# Altium schematic sheet Control and Gauge.SchDoc
size 431 x 279 mm; Date: Not shown in title block; ApprovedBy: Not shown in title block; CheckedBy: Not shown in title block; Author: Not shown in title block; CompanyName: Not shown in title block; Engineer: Not shown in title block; Organization: Not shown in title block; Address1: Not shown in title block; Address2: Not shown in title block; Address3: Not shown in title block; Address4: Not shown in title block; DocumentNumber: 1; Revision: Use project parameter SCH_Rev; SheetNumber: 2; SheetTotal: 3; PageSetup: Record=PageOptions|CenterHorizontal=True|CenterVertical=True|PrintScale=1.00|XCorrection=1.00|YCorrection=1.00|PrintKind=0|BorderSize=5000000|LeftOffset=0|BottomOffset=0|Orientation=2|PaperLength=1000|PaperWidth=1000|Scale=100|PaperSource=15|PrintQuality=600|MediaType=1|DitherType=10|PaperKind=Letter|PrintScaleMode=1; CurrentTime: Not shown in title block; CurrentDate: Not shown in title block; Time: Not shown in title block; DocumentFullPathAndName: Not shown in title block; DocumentName: Not shown in title block; ModifiedDate: Not shown in title block; ImagePath: Not shown in title block
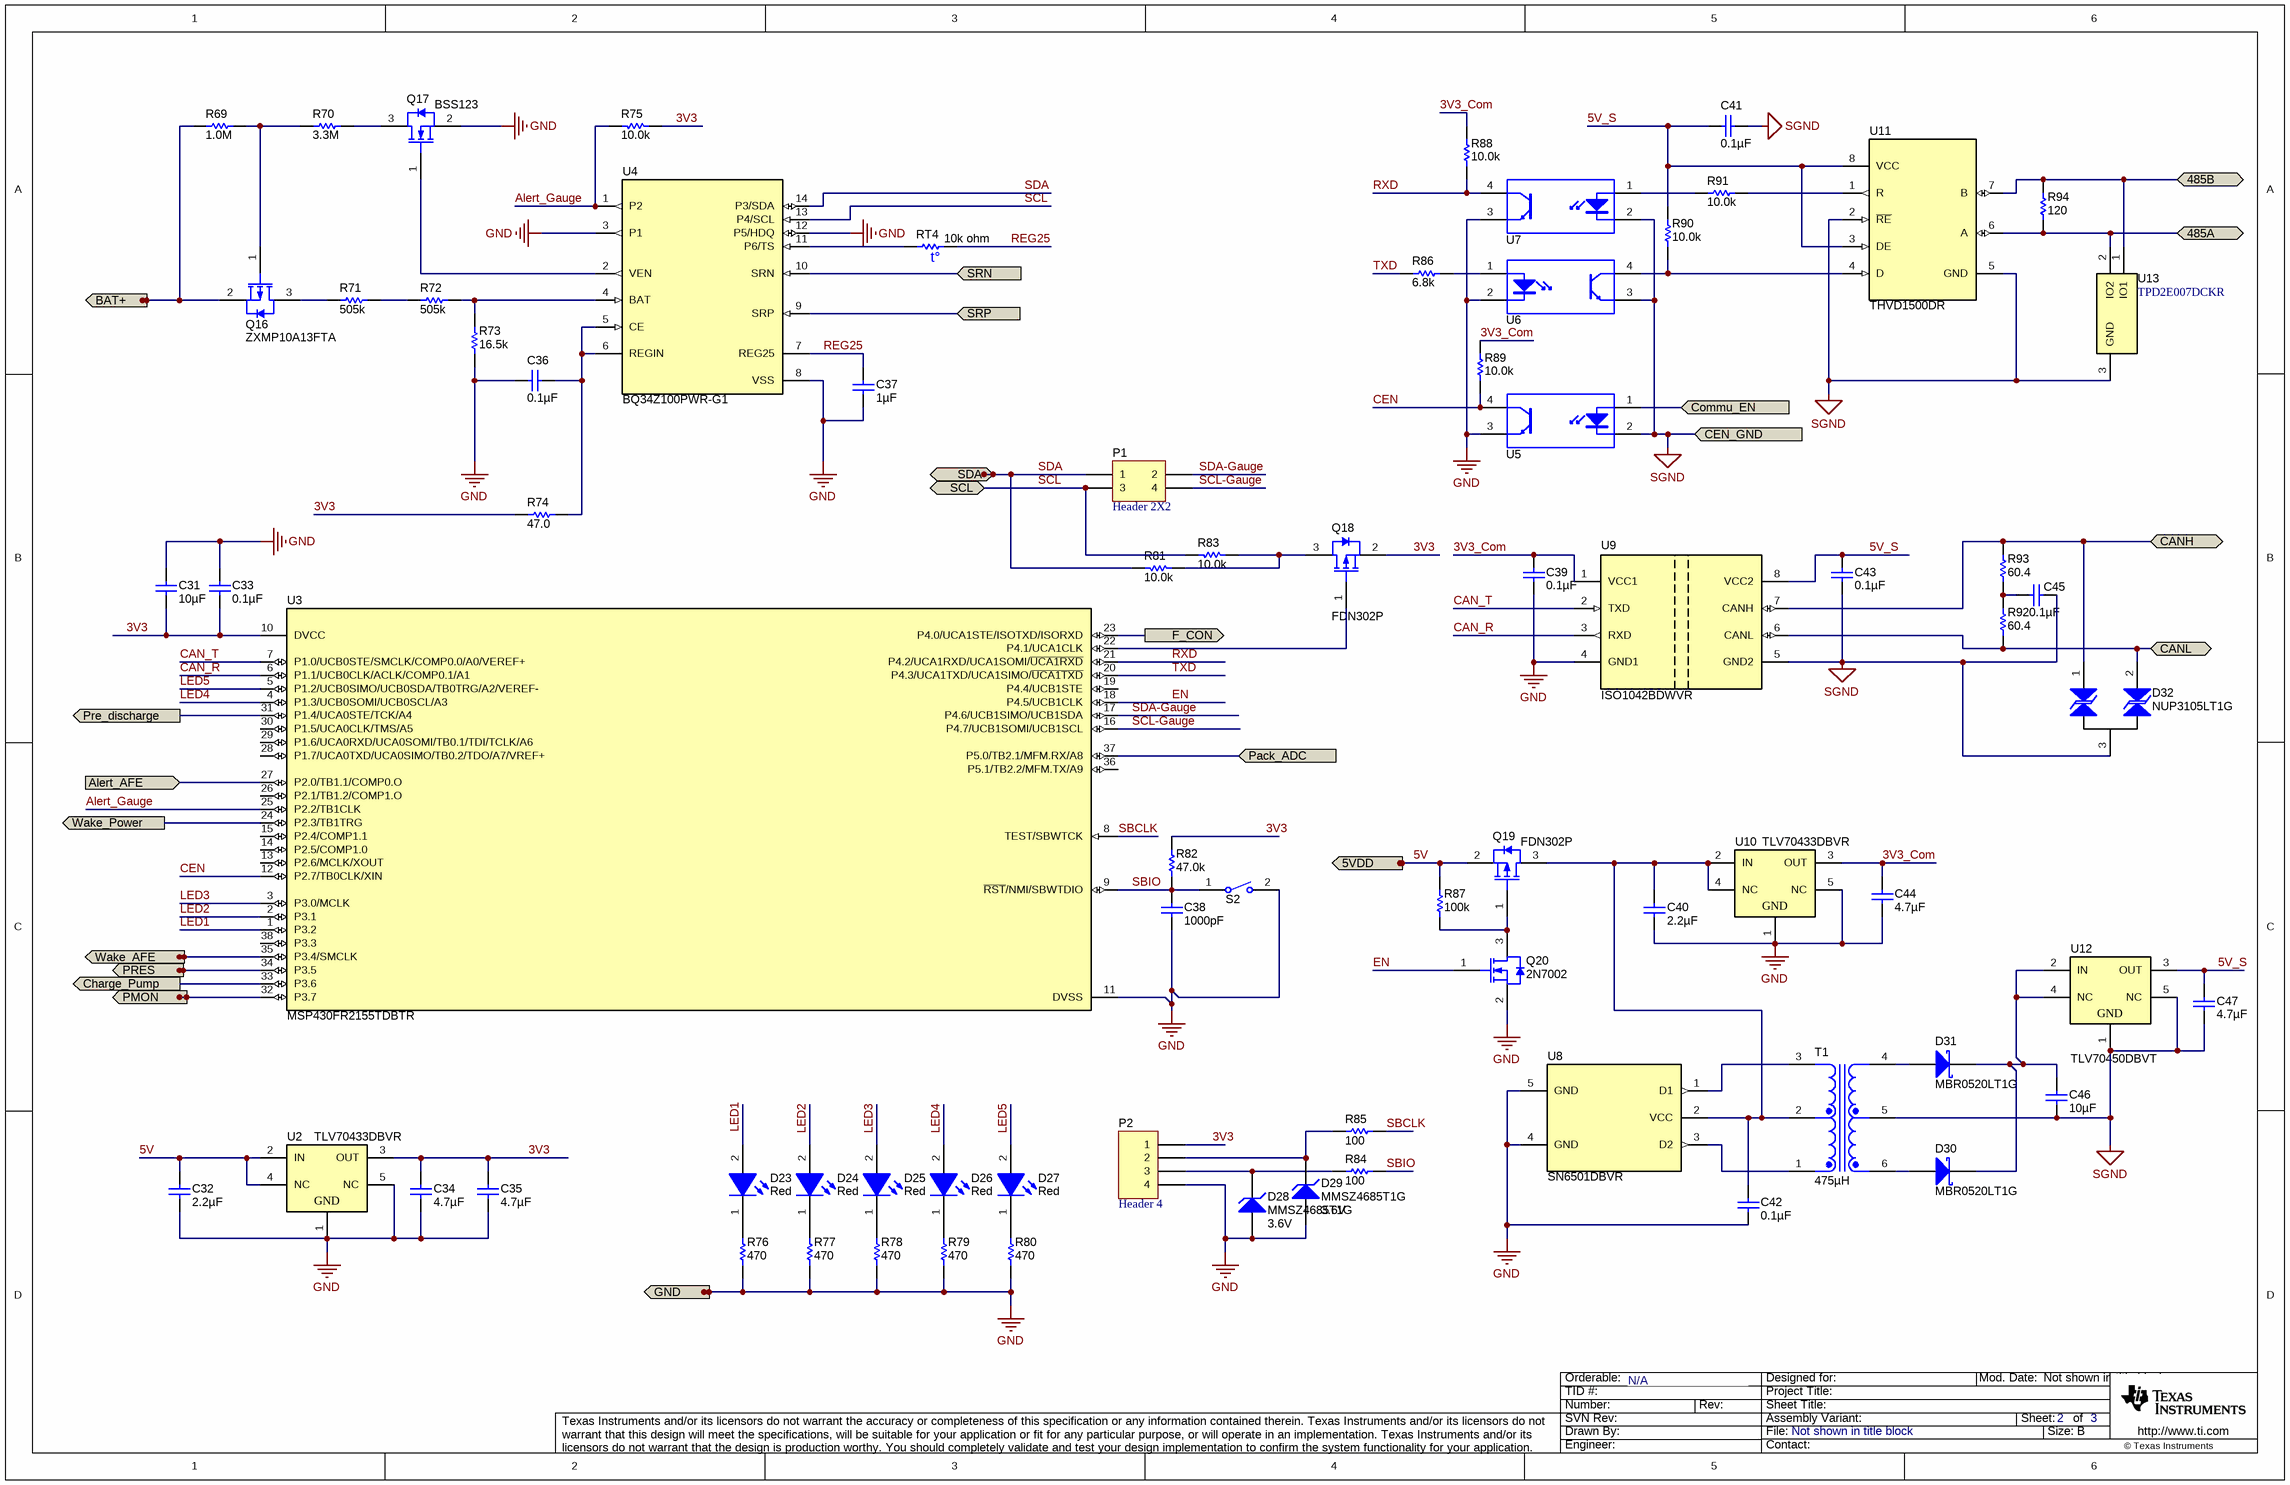
[diagram p0: Control and Gauge.SchDoc]

## Parts
C31  ValueDisplayed: 10µF  [0805_HV]  (hidden comment: CL21B106KOQNNNE)
C32  ValueDisplayed: 2.2µF  [0603]  (hidden comment: GRM188R71A225KE15D)
C33  ValueDisplayed: 0.1µF  [0603]  (hidden comment: GRM188R71C104KA01D)
C34  ValueDisplayed: 4.7µF  [0603]  (hidden comment: GRM188R61C475KAAJ)
C35  ValueDisplayed: 4.7µF  [0603]  (hidden comment: GRM188R61C475KAAJ)
C36  ValueDisplayed: 0.1µF  [0603]  (hidden comment: GRM188R71H104KA93D)
C37  ValueDisplayed: 1µF  [0603]  (hidden comment: GRM188R71C105KE15D)
C38  ValueDisplayed: 1000pF  [0603S]  (hidden comment: GRM1885C1H102JA01D)
C39  ValueDisplayed: 0.1µF  [0603]  (hidden comment: GRM188R71C104KA01D)
C40  ValueDisplayed: 2.2µF  [0603]  (hidden comment: GRM188R71A225KE15D)
C41  ValueDisplayed: 0.1µF  [0603]  (hidden comment: GRM188R71H104KA93D)
C42  ValueDisplayed: 0.1µF  [0603]  (hidden comment: GRM188R71C104KA01D)
C43  ValueDisplayed: 0.1µF  [0603]  (hidden comment: GRM188R71H104KA93D)
C44  ValueDisplayed: 4.7µF  [0603]  (hidden comment: GRM188R61C475KAAJ)
C45  ValueDisplayed: 0.1µF  [0603S]  (hidden comment: GRM188R71H104KA93D)
C46  ValueDisplayed: 10µF  [0805_HV]  (hidden comment: CL21B106KOQNNNE)
C47  ValueDisplayed: 4.7µF  [0603]  (hidden comment: GRM188R61C475KAAJ)
D23  value Red  [WL-SMCW_RED]  (hidden comment: 150060RS75000)
D24  value Red  [WL-SMCW_RED]  (hidden comment: 150060RS75000)
D25  value Red  [WL-SMCW_RED]  (hidden comment: 150060RS75000)
D26  value Red  [WL-SMCW_RED]  (hidden comment: 150060RS75000)
D27  value Red  [WL-SMCW_RED]  (hidden comment: 150060RS75000)
D28  MMSZ4685T1G  value 3.6V  [SOD-123]
D29  MMSZ4685T1G  value 3.6V  [SOD-123]
D30  MBR0520LT1G  [SOD-123]
D31  MBR0520LT1G  [SOD-123]
D32  NUP3105LT1G  [SOT-23]
P1  Header 2X2  [HDR2X2]
P2  Header 4  [HDR1X4]
Q16  ZXMP10A13FTA  [SOT-23]
Q17  BSS123  [SOT-23]
Q18  FDN302P  [SOT-23]
Q19  FDN302P  [SOT-23]
Q20  2N7002  [SOT-23]
R69  ValueDisplayed: 1.0M  [0603]  (hidden comment: CRCW06031M00JNEA)
R70  ValueDisplayed: 3.3M  [0603]  (hidden comment: CRCW06033M30JNEA)
R71  ValueDisplayed: 505k  [0603]  (hidden comment: RT0603BRD07505KL)
R72  ValueDisplayed: 505k  [0603]  (hidden comment: RT0603BRD07505KL)
R73  ValueDisplayed: 16.5k  [0603]  (hidden comment: RT0603BRD0716K5L)
R74  ValueDisplayed: 47.0  [0603]  (hidden comment: RC0603FR-0747RL)
R75  ValueDisplayed: 10.0k  [0603]  (hidden comment: CRCW060310K0FKEA)
R76  ValueDisplayed: 470  [0603]  (hidden comment: RC0603FR-07470RL)
R77  ValueDisplayed: 470  [0603]  (hidden comment: RC0603FR-07470RL)
R78  ValueDisplayed: 470  [0603]  (hidden comment: RC0603FR-07470RL)
R79  ValueDisplayed: 470  [0603]  (hidden comment: RC0603FR-07470RL)
R80  ValueDisplayed: 470  [0603]  (hidden comment: RC0603FR-07470RL)
R81  ValueDisplayed: 10.0k  [0603]  (hidden comment: CRCW060310K0FKEA)
R82  ValueDisplayed: 47.0k  [0603]  (hidden comment: RC0603FR-0747KL)
R83  ValueDisplayed: 10.0k  [0603]  (hidden comment: CRCW060310K0FKEA)
R84  ValueDisplayed: 100  [0603]  (hidden comment: CRCW0603100RFKEA)
R85  ValueDisplayed: 100  [0603]  (hidden comment: CRCW0603100RFKEA)
R86  ValueDisplayed: 6.8k  [0603]  (hidden comment: CRCW06036K80JNEA)
R87  ValueDisplayed: 100k  [0603]  (hidden comment: CRCW0603100KFKEA)
R88  ValueDisplayed: 10.0k  [0603]  (hidden comment: CRCW060310K0FKEA)
R89  ValueDisplayed: 10.0k  [0603]  (hidden comment: CRCW060310K0FKEA)
R90  ValueDisplayed: 10.0k  [0603]  (hidden comment: CRCW060310K0FKEA)
R91  ValueDisplayed: 10.0k  [0603S]  (hidden comment: CRCW060310K0FKEA)
R92  ValueDisplayed: 60.4  [0603S]  (hidden comment: RC0603FR-0760R4L)
R93  ValueDisplayed: 60.4  [0603S]  (hidden comment: RC0603FR-0760R4L)
R94  ValueDisplayed: 120  [0603]  (hidden comment: RC0603FR-07120RL)
RT4  value 10k ohm  [NTCALUG03]  (hidden comment: NTCALUG03A103G)
S2  RS-032G05A3-SM RT  [SW_RS-032G05A3-SM]  (value not drawn)
T1  ValueDisplayed: 475µH  [Wurth_760390012]  (hidden comment: 760390012)
U2  TLV70433DBVR  [DBV0005A_N]
U3  MSP430FR2155TDBTR  [DBT0038A_N]
U4  BQ34Z100PWR-G1  [PW0014A_N]
U5  TLP293(GB-TPL,E  [SO4]  (value not drawn)
U6  TLP293(GB-TPL,E  [SO4]  (value not drawn)
U7  TLP293(GB-TPL,E  [SO4]  (value not drawn)
U8  SN6501DBVR  [DBV0005A_N]
U9  ISO1042BDWVR  [DWV0008A]
U10  TLV70433DBVR  [DBV0005A_N]
U11  THVD1500DR  [D0008A_N]
U12  TLV70450DBVT  [DBV0005A_N]
U13  TPD2E007DCKR  [DCK0003A_N]

## Ports
5VDD, 485A (bidir), 485B (bidir), Alert_AFE (in), BAT+ (in), CANH (bidir), CANL (bidir), CEN_GND (in), Charge_Pump (out), Commu_EN (in), F_CON (out), GND, Pack_ADC (in), PMON (out), Pre_discharge (out), PRES (out), SCL (bidir), SDA (bidir), SRN (in), SRP (in), Wake_AFE (out), Wake_Power (out)

## Nets
GND: C31.1 C32.2 C33.1 C34.2 C35.2 C36.2 C37.2 C38.2 C39.1 C40.2 C42.2 C44.2 D28.2(A) D29.2(A) P2.4 Q17.2(S) Q20.2(S) R73.1 R76.1 R77.1 R78.1 R79.1 R80.1 S2.2 U2.1(GND) U2.5(NC) U3.11(DVSS) U4.3(P1) U4.8(VSS) U4.12(P5/HDQ) U5.3(E) U6.2(K) U7.3(E) U8.4(GND) U8.5(GND) U9.4(GND1) U10.1(GND) U10.5(NC) ; port GND
SGND: C41.2 C43.2 C45.1 C46.2 C47.2 D32.3 T1.5 U5.2(K) U6.3(E) U7.2(K) U9.5(GND2) U11.2(~{RE}) U11.5(GND) U12.1(GND) U12.5(NC) U13.3(GND) ; port CEN_GND
3V3: C31.2 C33.2 C34.1 C35.1 P2.1 Q18.2(S) R74.1 R75.1 R82.2 U2.3(OUT) U3.10(DVCC)
3V3_Com: C39.2 C44.1 R88.2 R89.2 U9.1(VCC1) U10.3(OUT)
5V: C32.1 Q19.2(S) R87.1 U2.2(IN) U2.4(NC) ; port 5VDD
5V_S: C41.1 C43.1 C47.1 R90.2 U9.8(VCC2) U11.3(DE) U11.8(VCC) U12.3(OUT)
485A: R94.2 U11.6(A) U13.2(IO2) ; port 485A
485B: R94.1 U11.7(B) U13.1(IO1) ; port 485B
Alert_AFE: U3.27(P2.0/TB1.1/COMP0.O) ; port Alert_AFE
Alert_Gauge: R75.2 U3.25(P2.2/TB1CLK) U4.1(P2)
BAT+: Q16.2(S) R69.1 ; port BAT+
CAN_R: U3.6(P1.1/UCB0CLK/ACLK/COMP0.1/A1) U9.3(RXD)
CAN_T: U3.7(P1.0/UCB0STE/SMCLK/COMP0.0/A0/VEREF+) U9.2(TXD)
CANH: D32.1 R93.1 U9.7(CANH) ; port CANH
CANL: D32.2 R92.2 U9.6(CANL) ; port CANL
CEN: R89.1 U3.12(P2.7/TB0CLK/XIN) U5.4(C)
Charge_Pump: U3.33(P3.6) ; port Charge_Pump
Commu_EN: U5.1(A) ; port Commu_EN
EN: Q20.1(G) U3.18(P4.5/UCB1CLK)
F_CON: U3.23(P4.0/UCA1STE/ISOTXD/ISORXD) ; port F_CON
LED1: D23.2(A) U3.1(P3.2)
LED2: D24.2(A) U3.2(P3.1)
LED3: D25.2(A) U3.3(P3.0/MCLK)
LED4: D26.2(A) U3.4(P1.3/UCB0SOMI/UCB0SCL/A3)
LED5: D27.2(A) U3.5(P1.2/UCB0SIMO/UCB0SDA/TB0TRG/A2/VEREF-)
Pack_ADC: U3.37(P5.0/TB2.1/MFM.RX/A8) ; port Pack_ADC
PMON: U3.32(P3.7) ; port PMON
Pre_discharge: U3.31(P1.4/UCA0STE/TCK/A4) ; port Pre_discharge
PRES: U3.34(P3.5) ; port PRES
REG25: C37.1 RT4.2 U4.7(REG25)
RXD: R88.1 U3.21(P4.2/UCA1RXD/UCA1SOMI/~{UCA1RXD}) U7.4(C)
SBCLK: R85.1 U3.8(TEST/SBWTCK)
SBIO: C38.1 R82.1 R84.1 S2.1 U3.9(~{RST}/NMI/SBWTDIO)
SCL: P1.3 R83.2 U4.13(P4/SCL) ; port SCL
SCL-Gauge: P1.4 U3.16(P4.7/UCB1SOMI/UCB1SCL)
SDA: P1.1 R81.2 U4.14(P3/SDA) ; port SDA
SDA-Gauge: P1.2 U3.17(P4.6/UCB1SIMO/UCB1SDA)
SRN: U4.10(SRN) ; port SRN
SRP: U4.9(SRP) ; port SRP
TXD: R86.2 U3.20(P4.3/UCA1TXD/UCA1SIMO/~{UCA1TXD})
Wake_AFE: U3.35(P3.4/SMCLK) ; port Wake_AFE
Wake_Power: U3.24(P2.3/TB1TRG) ; port Wake_Power
NetC36_1: C36.1 R74.2 U4.5(CE) U4.6(REGIN)
NetC40_1: C40.1 C42.1 Q19.3(D) T1.2 U8.2(VCC) U10.2(IN) U10.4(NC)
NetC45_2: C45.2 R92.1 R93.2
NetC46_1: C46.1 D30.1(K) D31.1(K) U12.2(IN) U12.4(NC)
NetD23_1: D23.1(K) R76.2
NetD24_1: D24.1(K) R77.2
NetD25_1: D25.1(K) R78.2
NetD26_1: D26.1(K) R79.2
NetD27_1: D27.1(K) R80.2
NetD28_1: D28.1(K) P2.3 R84.2
NetD29_1: D29.1(K) P2.2 R85.2
NetD30_2: D30.2(A) T1.6
NetD31_2: D31.2(A) T1.4
NetQ16_1: Q16.1(G) R69.2 R70.1
NetQ16_3: Q16.3(D) R71.1
NetQ17_1: Q17.1(G) U4.2(VEN)
NetQ17_3: Q17.3(D) R70.2
NetQ18_1: Q18.1(G) U3.22(P4.1/UCA1CLK)
NetQ18_3: Q18.3(D) R81.1 R83.1
NetQ19_1: Q19.1(G) Q20.3(D) R87.2
NetR71_2: R71.2 R72.1
NetR72_2: R72.2 R73.2 U4.4(BAT)
NetR86_1: R86.1 U6.1(A)
NetR90_1: R90.1 U6.4(C) U11.4(D)
NetR91_1: R91.1 U7.1(A)
NetR91_2: R91.2 U11.1(R)
NetRT4_1: RT4.1 U4.11(P6/TS)
NetT1_1: T1.1 U8.3(D2)
NetT1_3: T1.3 U8.1(D1)

Not connected (* = marked no-connect by the designer): U3 13(P2.6/MCLK/XOUT) 14(P2.5/COMP1.0) 15(P2.4/COMP1.1) 19(P4.4/UCB1STE) 26(P2.1/TB1.2/COMP1.O) 28(P1.7/UCA0TXD/UCA0SIMO/TB0.2/TDO/A7/VREF+) 29(P1.6/UCA0RXD/UCA0SOMI/TB0.1/TDI/TCLK/A6) 30(P1.5/UCA0CLK/TMS/A5) 36(P5.1/TB2.2/MFM.TX/A9) 38(P3.3)

## Notes on the sheet
- N/A
- Drawn By:
- SVN Rev:
- Number:
- TID #:
- Orderable:
- Rev:
- Sheet Title:
- File:
- Project Title:
- Designed for:
- Assembly Variant:
- Mod. Date:
- Sheet:
- Size:
- of
- B
- http://www.ti.com
- Texas Instruments and/or its licensors do not warrant the accuracy or completeness of this specification or any information contained therein. Texas Instruments and/or its licensors do not warrant that this design will meet the specifications, will be suitable for your application or fit for any particular purpose, or will operate in an implementation. Texas Instruments and/or its licensors do not warrant that the design is production worthy. You should completely validate and test your design implementation to confirm the system functionality for your application.
- Engineer:
- Contact:
- © Texas Instruments
- (in symbol NTCALUG03A103G) t°

## Library data of the parts
C31 C46 = CL21B106KOQNNNE: CAP, CERM, 10 µF, 16 V,+/- 10%, X7R, 0805; Manufacturer: Samsung Electro-Mechanics; Polarized: N; CompType: Capacitor; Value: 10uF; U/M: EA; Cap_F: 0.00001; Tolerance_%: 10; VDC_V: 16; Value2: 16V; TaMin_C: -55; TaMax_C: 125; Cap_Case: 0805; SizeArea_mm2: 2.5; SizeAreaWB_mm2: 6.75; SizeX_mm: 2; SizeY_mm: 1.25; SizeZ_mm: 1.45; AEC Category: Q200; Green_Lifecycle: Active; Green_REACh: Passed; SymbolVersion: 2008-07-09; PartNumber: CL21B106KOQNNNE; PackageReference: 0805; RoHS: Y; MountType: SMT; Technology: Ceramic; TempCo: X7R; Published: 2008-06-19; Publisher: Texas Instruments; LatestRevisionDate: 2017-06-22; ComponentLink1Description: Datasheet link; ComponentLink1URL: http://www.samsungsem.com/servlet/FileDownload?type=spec&file=CL21B106KOQNNNE.pdf; Supplier 1: Digi-Key; Supplier Part Number 1: 1276-2872-1-ND; AEC Qualified: ?; Green_EU RoHS: Passed; Green_EU RoHS-2: Incomplete
C32 C40 = GRM188R71A225KE15D: CAP, CERM, 2.2 µF, 10 V,+/- 10%, X7R, 0603; Manufacturer: MuRata; Polarized: N; CompType: Capacitor; Value: 2.2uF; U/M: EA; Cap_F: 0.0000022; Tolerance_%: 10; ESR_ohm: 0.009; Value1: 0.009 ohm; Value2: 10V; TaMin_C: -55; TaMax_C: 125; SizeArea_mm2: 1.28; SizeAreaWB_mm2: 4.68; SizeX_mm: 1.6; SizeY_mm: 0.8; SizeZ_mm: 1; AEC Category: Q200; Green_Lifecycle: Active; Green_REACh: Passed; SymbolVersion: 2008-07-09; PartNumber: GRM188R71A225KE15D; PackageReference: 0603; RoHS: Y; VDC_V: 10; MountType: SMT; Technology: Ceramic; TempCo: X7R; Cap_Case: 0603; Published: 2008-06-19; Publisher: Texas Instruments; LatestRevisionDate: 2017-06-22; ComponentLink1Description: Datasheet link; ComponentLink1URL: http://search.murata.co.jp/Ceramy/PnsearchViewAction.do?HnOFG=ON&HnNFG=ON&SEL_CNT=50&sLang=en&sKey=GRM188R71A225KE15D&x=9&y=9&search=startwith; Supplier 1: Digi-Key; Supplier Part Number 1: 490-4520-1-ND; Supplier 2: Mouser; Supplier Part Number 2: 81-GRM188R71A225KE15; Supplier 3: Farnell; Supplier Part Number 3: 1797012; AEC Qualified: ?; Green_EU RoHS: Passed; Green_EU RoHS-2: Incomplete
C33 C39 C42 = GRM188R71C104KA01D: CAP, CERM, 0.1 µF, 16 V,+/- 10%, X7R, 0603; Manufacturer: MuRata; Polarized: N; CompType: Capacitor; Value: 0.1uF; U/M: EA; Cap_F: 0.0000001; Tolerance_%: 10; VDC_V: 16; Value2: 16V; TaMin_C: -55; TaMax_C: 125; SizeArea_mm2: 1.28; SizeAreaWB_mm2: 4.68; SizeX_mm: 1.6; SizeY_mm: 0.8; SizeZ_mm: 1; AEC Category: Q200; Green_Lifecycle: Active; Green_REACh: Passed; SymbolVersion: 2008-07-09; PartNumber: GRM188R71C104KA01D; PackageReference: 0603; RoHS: Y; MountType: SMT; Technology: Ceramic; TempCo: X7R; Cap_Case: 0603; Published: 2008-06-19; Publisher: Texas Instruments; LatestRevisionDate: 2017-06-22; ComponentLink1Description: Datasheet link; ComponentLink1URL: http://search.murata.co.jp/Ceramy/PnsearchViewAction.do?HnOFG=ON&HnNFG=ON&SEL_CNT=50&sLang=en&sKey=GRM188R71C104KA01D&x=9&y=9&search=startwith; Supplier 1: Digi-Key; Supplier Part Number 1: 490-1532-1-ND; Supplier 2: Mouser; Supplier Part Number 2: 81-GRM39X104K16; Supplier 3: Farnell; Supplier Part Number 3: 1828890; AEC Qualified: ?; Green_EU RoHS: Passed; Green_EU RoHS-2: Passed
C34 C35 C44 C47 = GRM188R61C475KAAJ: CAP, CERM, 4.7 µF, 16 V,+/- 10%, X5R, 0603; Manufacturer: MuRata; Polarized: N; CompType: Capacitor; Value: 4.7uF; U/M: EA; Cap_F: 0.0000047; Tolerance_%: 10; VDC_V: 16; Value2: 16V; TaMin_C: -55; TaMax_C: 85; SizeArea_mm2: 1.28; SizeAreaWB_mm2: 4.68; SizeX_mm: 1.6; SizeY_mm: 0.8; SizeZ_mm: 1; AEC Category: Q200; Green_Lifecycle: Active; Green_REACh: Passed; SymbolVersion: 2008-07-09; PartNumber: GRM188R61C475KAAJ; PackageReference: 0603; RoHS: Y; MountType: SMT; Technology: Ceramic; TempCo: X5R; Cap_Case: 0603; Published: 2008-06-19; Publisher: Texas Instruments; LatestRevisionDate: 2017-06-22; ComponentLink1Description: Datasheet link; ComponentLink1URL: http://psearch.murata.com/capacitor/product/GRM188R61C475KAAJ%23.pdf; Supplier 1: Digi-Key; Supplier Part Number 1: 490-10481-1-ND; Supplier 2: Mouser; Supplier Part Number 2: 81-GRM188R61C475KAJD; AEC Qualified: N; AEC Grade: N/A; Green_EU RoHS: Passed; Green_EU RoHS-2: Incomplete
C36 C41 C43 = GRM188R71H104KA93D: CAP, CERM, 0.1 µF, 50 V,+/- 10%, X7R, 0603; Manufacturer: MuRata; Polarized: N; CompType: Capacitor; Value: 0.1uF; U/M: EA; Cap_F: 0.0000001; Tolerance_%: 10; VDC_V: 50; Value2: 50V; TaMin_C: -55; TaMax_C: 125; SizeArea_mm2: 1.28; SizeAreaWB_mm2: 4.68; SizeX_mm: 1.6; SizeY_mm: 0.8; SizeZ_mm: 1; AEC Category: Q200; Green_Lifecycle: Active; Green_REACh: Passed; SymbolVersion: 2008-07-09; PartNumber: GRM188R71H104KA93D; PackageReference: 0603; RoHS: Y; MountType: SMT; Technology: Ceramic; TempCo: X7R; Cap_Case: 0603; Published: 2008-06-19; Publisher: Texas Instruments; LatestRevisionDate: 2017-06-22; ComponentLink1Description: Datasheet link; ComponentLink1URL: http://search.murata.co.jp/Ceramy/PnsearchViewAction.do?HnOFG=ON&HnNFG=ON&SEL_CNT=50&sLang=en&sKey=GRM188R71H104KA93D&x=9&y=9&search=startwith; Supplier 1: Digi-Key; Supplier Part Number 1: 490-1519-1-ND; Supplier 2: Mouser; Supplier Part Number 2: 81-GRM39X104K50D; Supplier 3: Farnell; Supplier Part Number 3: 8820023; AEC Qualified: ?; Green_EU RoHS: Passed; Green_EU RoHS-2: Incomplete
C37 = GRM188R71C105KE15D: CAP, CERM, 1 µF, 16 V,+/- 10%, X7R, 0603; Manufacturer: MuRata; Polarized: N; CompType: Capacitor; Value: 1uF; U/M: EA; Cap_F: 0.000001; Tolerance_%: 10; VDC_V: 16; Value2: 16V; TaMin_C: -55; TaMax_C: 125; SizeArea_mm2: 1.28; SizeAreaWB_mm2: 4.68; SizeX_mm: 1.6; SizeY_mm: 0.8; SizeZ_mm: 1; AEC Category: Q200; SymbolVersion: 2008-07-09; PartNumber: GRM188R71C105KE15D; PackageReference: 0603; RoHS: Y; MountType: SMT; Technology: Ceramic; TempCo: X7R; Cap_Case: 0603; Published: 2008-06-19; Publisher: Texas Instruments; LatestRevisionDate: 2017-06-22; ComponentLink1Description: Datasheet link; ComponentLink1URL: http://search.murata.co.jp/Ceramy/image/img/A01X/G101/ENG/GRM188R71C105KE15-01.pdf; Supplier 1: Digi-Key; Supplier Part Number 1: 490-10734-1-ND; Supplier 2: Mouser; Supplier Part Number 2: 81-GRM188R71C105KE5D; AEC Qualified: N; AEC Grade: N/A
C38 = GRM1885C1H102JA01D: CAP, CERM, 1000 pF, 50 V,+/- 5%, C0G/NP0, 0603; Manufacturer: MuRata; Polarized: N; CompType: Capacitor; Value: 1000pF; U/M: EA; Cap_F: 0.000000001; Tolerance_%: 5; VDC_V: 50; Value2: 50V; TaMin_C: -55; TaMax_C: 125; Cap_Case: 0603; SizeArea_mm2: 1.28; SizeAreaWB_mm2: 4.68; SizeX_mm: 1.6; SizeY_mm: 0.8; SizeZ_mm: 1; AEC Category: Q200; Green_Lifecycle: Active; Green_REACh: Passed; SymbolVersion: 2008-07-09; PartNumber: GRM1885C1H102JA01D; PackageReference: 0603; RoHS: Y; MountType: SMT; Technology: Ceramic; TempCo: C0G/NP0; Published: 2008-06-19; Publisher: Texas Instruments; LatestRevisionDate: 2017-06-22; ComponentLink1Description: Datasheet link; ComponentLink1URL: http://search.murata.co.jp/Ceramy/PnsearchViewAction.do?HnOFG=ON&HnNFG=ON&SEL_CNT=50&sLang=en&sKey=GRM1885C1H102JA01D&x=9&y=9&search=startwith; Supplier 1: Digi-Key; Supplier Part Number 1: 490-1451-1-ND; Supplier 2: Mouser; Supplier Part Number 2: 81-GRM39C102J50; Supplier 3: Farnell; Supplier Part Number 3: 8819920; AEC Qualified: ?; Green_EU RoHS: Passed; Green_EU RoHS-2: Incomplete
C45 = GRM188R71H104KA93D: CAP, CERM, 0.1 µF, 50 V,+/- 10%, X7R, 0603; Manufacturer: MuRata; Polarized: N; CompType: Capacitor; Value: 0.1uF; U/M: EA; Cap_F: 0.0000001; Tolerance_%: 10; VDC_V: 50; Value2: 50V; TaMin_C: -55; TaMax_C: 125; Cap_Case: 0603; SizeArea_mm2: 1.28; SizeAreaWB_mm2: 4.68; SizeX_mm: 1.6; SizeY_mm: 0.8; SizeZ_mm: 1; AEC Category: Q200; Green_Lifecycle: Active; Green_REACh: Passed; SymbolVersion: 2008-07-09; PartNumber: GRM188R71H104KA93D; PackageReference: 0603; RoHS: Y; MountType: SMT; Technology: Ceramic; TempCo: X7R; Published: 2008-06-19; Publisher: Texas Instruments; LatestRevisionDate: 2017-06-22; ComponentLink1Description: Datasheet link; ComponentLink1URL: http://search.murata.co.jp/Ceramy/PnsearchViewAction.do?HnOFG=ON&HnNFG=ON&SEL_CNT=50&sLang=en&sKey=GRM188R71H104KA93D&x=9&y=9&search=startwith; Supplier 1: Digi-Key; Supplier Part Number 1: 490-1519-1-ND; Supplier 2: Mouser; Supplier Part Number 2: 81-GRM39X104K50D; Supplier 3: Farnell; Supplier Part Number 3: 8820023; AEC Qualified: ?; Green_EU RoHS: Passed; Green_EU RoHS-2: Incomplete
D23-D27 = 150060RS75000: LED, Red, SMD; Manufacturer: Wurth Elektronik; Type: AlInGaP; Vf_V: 2; Value2: 2V; Io_A: 0.03; Vr_V: 5; Tjmax_C: 85; Power_TotalModule: 0.072; Value1: 0.072W; Angle: 140; U/M: EA; Green_Lifecycle: Active; Green_REACh: Passed; CompType: LED; PartNumber: 150060RS75000; SymbolVersion: 2008-11-06; MountType: SMT; RoHS: Y; PackageReference: LED_0603; Color: Red; Published: 2008-07-11; Publisher: Texas Instruments; ComponentLink1URL: http://katalog.we-online.de/led/datasheet/150060RS75000.pdf; ComponentLink1Description: Datasheet link; LatestRevisionDate: 2017-06-23; Supplier 1: Digi-Key; Supplier Part Number 1: 732-4978-1-ND; Supplier 2: Newark; Supplier Part Number 2: 95W3795; Supplier 3: Mouser; Supplier Part Number 3: 710-150060RS75000; Green_EU RoHS: Passed; Green_EU RoHS-2: Incomplete
D28 D29 = MMSZ4685T1G: Diode, Zener, 3.6 V, 500 mW, SOD-123; Manufacturer: ON Semiconductor; SymbolCreator: a0412235; U/M: EA; Power_W: 0.5; Vz_V: 3.6; Value1: 0.5W; RJA_CperW: 340; SizeAreaWB_mm2: 13.095; SizeArea_mm2: 6.545; SizeX_mm: 3.85; SizeY_mm: 1.7; SizeZ_mm: 1.35; AEC Category: Q101; Green_Lifecycle: Active; Green_REACh: Passed; SymbolVersion: 2010-08-25; PartNumber: MMSZ4685T1G; PackageReference: SOD-123; CompType: Zener; Vr_V: N/A; MountType: SMT; RoHS: Y; ComponentLink1Description: Datasheet link; ComponentLink1URL: http://www.onsemi.com/pub_link/Collateral/MMSZ4678T1-D.PDF; Published: 2008-10-08; Publisher: Texas Instruments; LatestRevisionDate: 2017-06-20; LatestRevisionNote: Updated Supplier Data; Supplier 1: Digi-Key; Supplier Part Number 1: MMSZ4685T1GOSCT-ND; Supplier 2: Mouser; Supplier Part Number 2: 863-MMSZ4685T1G; Supplier 3: Farnell; Supplier Part Number 3: 1651592; AEC Qualified: ?; Green_EU RoHS: Passed; Green_EU RoHS-2: Passed
D30 D31 = MBR0520LT1G: Diode, Schottky, 20 V, 0.5 A, SOD-123; Manufacturer: ON Semiconductor; U/M: EA; Vf_V: 0.385; Value: 20V; Value1: 0.5A; Value2: 0.385V; Io_A: 0.5; Vr_V: 20; TJmax_C: 125; RJC_CperW: 150; SizeAreaWB_mm2: 13.095; SizeArea_mm2: 6.545; SizeX_mm: 3.85; SizeY_mm: 1.7; SizeZ_mm: 1.35; AEC Category: Q101; Green_Lifecycle: Active; Green_REACh: Passed; CompType: Diode; SymbolVersion: 2008-12-08; PartNumber: MBR0520LT1G; PackageReference: SOD-123; MountType: SMT; Type: Schottky; RoHS: Y; Published: 2008-06-26; Publisher: Texas Instruments; LatestRevisionDate: 2017-06-26; ComponentLink1Description: Datasheet link; ComponentLink1URL: http://www.onsemi.com/pub_link/Collateral/MBR0520LT1-D.PDF; Supplier 1: Digi-Key; Supplier Part Number 1: MBR0520LT1GOSCT-ND; Supplier 2: Newark; Supplier Part Number 2: 48K7498; Supplier 3: Mouser; Supplier Part Number 3: 863-MBR0520LT1G; AEC Qualified: ?; Green_EU RoHS: Passed; Green_EU RoHS-2: Passed
D32 = NUP2105LT1G: Diode, TVS, Bi, 24 V, SOT-23; Manufacturer: ON Semiconductor; SymbolCreator: a0411947; Value: 24V; U/M: EA; Power_W: 0.35; Vr_V: 24; Value1: 0.35W; SizeAreaWB_mm2: 14; SizeArea_mm2: 7.5; SizeX_mm: 2.5; SizeY_mm: 3; SizeZ_mm: 1.1; AEC Category: Q101; SymbolVersion: 2013-09-30; PartNumber: NUP3105LT1G; PackageReference: SOT-23; CompType: TVS; Vz_V: N/A; MountType: SMT; RoHS: Y; ComponentLink1Description: Datasheet link; ComponentLink1URL: http://www.onsemi.com/pub_link/Collateral/NUP2105L-D.PDF; Published: 2008-10-08; Publisher: Texas Instruments; LatestRevisionDate: 2017-06-20; LatestRevisionNote: Updated Supplier Data; Supplier 1: Digi-Key; Supplier Part Number 1: NUP2105LT1GOSCT-ND; Supplier 2: Newark; Supplier Part Number 2: 45J2202; Supplier 3: Mouser; Supplier Part Number 3: 863-NUP2105LT1G; AEC Qualified: ?
P1 = Header 2X2: Header, 2-Pin, Dual row; LatestRevisionDate: 17-Jul-2002; LatestRevisionNote: Re-released for DXP Platform.; Publisher: Altium Limited
P2 = Header 4: Header, 4-Pin; LatestRevisionDate: 17-Jul-2002; LatestRevisionNote: Re-released for DXP Platform.; Publisher: Altium Limited
Q16 = ZXMP10A13FTA: MOSFET, P-CH, -100 V, -0.6 A, SOT-23; Manufacturer: Diodes Inc.; Alternate Manufacturer: None; U/M: EA; ChType: P; Value: -100V; Value1: 1 ohm; Rdson45_ohm: 1; Value2: 3.5 nC; QgTyp_nC: 3.5; Vgs_V: -4; SizeAreaWB_mm2: 14; SizeArea_mm2: 7.5; SizeX_mm: 2.5; SizeY_mm: 3; SizeZ_mm: 1.1; AEC Category: Q101; Green_Lifecycle: Active; Green_REACh: Passed; SymbolVersion: 2008-07-09; PartNumber: ZXMP10A13FTA; PackageReference: SOT-23; CompType: MOSFET; VdsMax_V: -100; IdsMax_A: -0.6; RoHS: Y; MountType: SMT; Published: 2008-06-19; Publisher: Texas Instruments; LatestRevisionDate: 2017-06-26; LatestRevisionNote: Added parts.; ComponentLink1Description: Datasheet link; ComponentLink1URL: http://www.diodes.com/datasheets/ZXMP10A13F.pdf; Supplier 1: Digi-Key; Supplier Part Number 1: ZXMP10A13FCT-ND; Supplier 2: Newark; Supplier Part Number 2: 12T2274; Supplier 3: Mouser; Supplier Part Number 3: 522-ZXMP10A13FTA; AEC Qualified: ?; Green_EU RoHS: Passed; Green_EU RoHS-2: Passed
Q17 = BSS123: MOSFET, N-CH, 100 V, 0.17 A, SOT-23; Manufacturer: Fairchild Semiconductor; Alternate Manufacturer: None; U/M: EA; ChType: N; Value: 100V; VdsMax_V: 100; Value1: 10 ohm; Rdson45_ohm: 10; Value2: 1.8 nC; QgTyp_nC: 1.8; Vgs_V: 20; IdsMax_A: 0.17; SizeAreaWB_mm2: 14; SizeArea_mm2: 7.5; SizeX_mm: 2.5; SizeY_mm: 3; SizeZ_mm: 1.1; AEC Category: Q101; Green_Lifecycle: Active; Green_REACh: Passed; SymbolVersion: 2008-07-28; CompType: MOSFET; PartNumber: BSS123; PackageReference: SOT-23; RoHS: Y; MountType: SMT; Published: 2008-06-19; Publisher: Texas Instruments; LatestRevisionDate: 2017-06-26; LatestRevisionNote: Added parts.; ComponentLink1Description: Datasheet link; ComponentLink1URL: http://www.fairchildsemi.com/ds/BS/BSS123.pdf; Supplier 1: Digi-Key; Supplier Part Number 1: BSS123NCT-ND; Supplier 2: Newark; Supplier Part Number 2: 58K8768; Supplier 3: Mouser; Supplier Part Number 3: 512-BSS123; AEC Qualified: ?; Green_EU RoHS: Passed; Green_EU RoHS-2: Passed
Q18 Q19 = FDN302P: MOSFET, P-CH, -20 V, -2.4 A, SOT-23; Manufacturer: Fairchild Semiconductor; Alternate Manufacturer: None; U/M: EA; ChType: P; Value: -20V; Value1: 0.055 ohm; Rdson45_ohm: 0.055; Value2: 9 nC; QgTyp_nC: 9; Vgs_V: -12; SizeAreaWB_mm2: 14; SizeArea_mm2: 7.5; SizeX_mm: 2.5; SizeY_mm: 3; SizeZ_mm: 1.1; AEC Category: Q101; Green_Lifecycle: Active; Green_REACh: Passed; SymbolVersion: 2008-07-09; PartNumber: FDN302P; PackageReference: SOT-23; CompType: MOSFET; VdsMax_V: -20; IdsMax_A: -2.4; RoHS: Y; MountType: SMT; Published: 2008-06-19; Publisher: Texas Instruments; LatestRevisionDate: 2017-06-26; LatestRevisionNote: Added parts.; ComponentLink1Description: Datasheet link; ComponentLink1URL: http://www.fairchildsemi.com/ds/FD/FDN302P.pdf; Supplier 1: Digi-Key; Supplier Part Number 1: FDN302PCT-ND; Supplier 2: Newark; Supplier Part Number 2: 58K8838; Supplier 3: Mouser; Supplier Part Number 3: 512-FDN302P; AEC Qualified: ?; Green_EU RoHS: Passed; Green_EU RoHS-2: Passed
Q20 = 2N7002: MOSFET, N-CH, 60 V, 115 A, SOT-23; Manufacturer: Fairchild Semiconductor; Alternate Manufacturer: None; U/M: EA; ChType: N; Value: 60V; VdsMax_V: 60; Value1: ? ohm; Value2: ? nC; Vgs_V: 20; IdsMax_A: 115; SizeAreaWB_mm2: 14; SizeArea_mm2: 7.5; SizeX_mm: 2.5; SizeY_mm: 3; SizeZ_mm: 1.1; AEC Category: Q101; Green_Lifecycle: Active; Green_REACh: Passed; SymbolVersion: 2008-07-28; CompType: MOSFET; PartNumber: 2N7002; PackageReference: SOT-23; RoHS: Y; MountType: SMT; Published: 2008-06-19; Publisher: Texas Instruments; LatestRevisionDate: 2017-06-26; LatestRevisionNote: Added parts.; ComponentLink1Description: Datasheet link; ComponentLink1URL: https://www.fairchildsemi.com/datasheets/2N/2N7000.pdf; Supplier 1: Digi-Key; Supplier Part Number 1: 2N7002NCT-ND; Supplier 2: Newark; Supplier Part Number 2: 58K9651; Supplier 3: Mouser; Supplier Part Number 3: 512-2N7002; AEC Qualified: N; Green_EU RoHS: Passed; Green_EU RoHS-2: Passed
R69 = CRCW06031M00JNEA: RES, 1.0 M, 5%, 0.1 W, 0603; Manufacturer: Vishay-Dale; CompType: Resistor; Value: 1.0Meg; Res_ohm: 1000000; Value_Code: 1M00; Tolerance_%: 5; Power_W: 0.1; Value2: 0.1W; VDC_V: 75; TempCo: 200 ppm/C; SizeArea_mm2: 1.28; SizeX_mm: 1.6; SizeY_mm: 0.8; SizeZ_mm: 1; EIA_Code: E24; U/M: EA; AEC Category: Q200; Green_Lifecycle: Active; Green_REACh: Passed; SymbolVersion: 2009-05-29; PartNumber: CRCW06031M00JNEA; PackageReference: 0603; RoHS: Y; Value1: 5%; MountType: SMT; Technology: Thick Film; Published: 2008-06-26; Publisher: Texas Instruments; LatestRevisionDate: 2017-06-13; ComponentLink1Description: Datasheet link; ComponentLink1URL: http://www.vishay.com/docs/20035/dcrcwe3.pdf; Supplier 1: Digi-Key; Supplier Part Number 1: 541-1.0MGCT-ND; Supplier 2: Newark; Supplier Part Number 2: 59M6756; Supplier 3: Mouser; Supplier Part Number 3: 71-CRCW0603J-1.0M-E3; AEC Qualified: ?; Green_EU RoHS: Passed with Exemption; Green_EU RoHS-2: Passed
R70 = CRCW06033M30JNEA: RES, 3.3 M, 5%, 0.1 W, 0603; Manufacturer: Vishay-Dale; CompType: Resistor; Value: 3.3Meg; Res_ohm: 3300000; Value_Code: 3M30; Tolerance_%: 5; Power_W: 0.1; Value2: 0.1W; VDC_V: 75; TempCo: 200 ppm/C; SizeArea_mm2: 1.28; SizeX_mm: 1.6; SizeY_mm: 0.8; SizeZ_mm: 1; EIA_Code: E24; U/M: EA; AEC Category: Q200; Green_Lifecycle: Active; Green_REACh: Passed; SymbolVersion: 2009-05-29; PartNumber: CRCW06033M30JNEA; PackageReference: 0603; RoHS: Y; Value1: 5%; MountType: SMT; Technology: Thick Film; Published: 2008-06-26; Publisher: Texas Instruments; LatestRevisionDate: 2017-06-13; ComponentLink1Description: Datasheet link; ComponentLink1URL: http://www.vishay.com/docs/20035/dcrcwe3.pdf; Supplier 1: Digi-Key; Supplier Part Number 1: 541-3.3MGCT-ND; Supplier 2: Mouser; Supplier Part Number 2: 71-CRCW0603J-3.3M-E3; AEC Qualified: ?; Green_EU RoHS: Passed with Exemption; Green_EU RoHS-2: Passed
R71 R72 = RT0603BRD07505KL: RES, 505 k, 0.1%, 0.1 W, 0603; Manufacturer: Yageo America; CompType: Resistor; Value: 505k; Res_ohm: 505000; Tolerance_%: 0.1; Value2: 0.1W; VDC_V: 75; TempCo: 25 ppm/C; SizeArea_mm2: 1.28; SizeX_mm: 1.6; SizeY_mm: 0.8; SizeZ_mm: 1; EIA_Code: E192; U/M: EA; AEC Category: Q200; SymbolVersion: 2009-05-29; PartNumber: RT0603BRD07505KL; PackageReference: 0603; RoHS: Y; Value_Code: 505k; Value1: 0.1%; Power_W: 0.1; MountType: SMT; Technology: Thin Film; Published: 2008-06-26; Publisher: Texas Instruments; LatestRevisionDate: 2017-06-13; ComponentLink1Description: Datasheet link; ComponentLink1URL: http://www.yageo.com/pdf/PYu-RT_1-to-0.05_RoHS_L_3.pdf; AEC Qualified: ?
R73 = RT0603BRD0716K5L: RES, 16.5 k, 0.1%, 0.1 W, 0603; Manufacturer: Yageo America; CompType: Resistor; Value: 16.5k; Res_ohm: 16500; Value_Code: 16k5; Tolerance_%: 0.1; Value2: 0.1W; VDC_V: 75; TempCo: 25 ppm/C; SizeArea_mm2: 1.28; SizeX_mm: 1.6; SizeY_mm: 0.8; SizeZ_mm: 1; EIA_Code: E192; U/M: EA; AEC Category: Q200; SymbolVersion: 2009-05-29; PartNumber: RT0603BRD0716K5L; PackageReference: 0603; RoHS: Y; Value1: 0.1%; Power_W: 0.1; MountType: SMT; Technology: Thin Film; Published: 2008-06-26; Publisher: Texas Instruments; LatestRevisionDate: 2017-06-13; ComponentLink1Description: Datasheet link; ComponentLink1URL: http://www.yageo.com/pdf/PYu-RT_1-to-0.05_RoHS_L_3.pdf; AEC Qualified: ?
R74 = RC0603FR-0747RL: RES, 47.0, 1%, 0.1 W, 0603; Manufacturer: Yageo America; CompType: Resistor; Value: 47.0; Res_ohm: 47; Value_Code: 47R0; Tolerance_%: 1; Power_W: 0.1; Value2: 0.1W; VDC_V: 150; TempCo: 200 ppm/C; SizeArea_mm2: 1.28; SizeX_mm: 1.6; SizeY_mm: 0.8; U/M: EA; AEC Category: Q200; Green_Lifecycle: Active; Green_REACh: Passed; SymbolVersion: 2009-05-29; PartNumber: RC0603FR-0747RL; PackageReference: 0603; RoHS: Y; Value1: 1%; MountType: SMT; Technology: Thick Film; SizeZ_mm: 1; Published: 2008-06-26; Publisher: Texas Instruments; LatestRevisionDate: 2017-06-13; ComponentLink1Description: Datasheet link; ComponentLink1URL: http://www.yageo.com/pdf/Pu-RC0603_51_PbFree_L_2.pdf; Supplier 1: Digi-Key; Supplier Part Number 1: 311-47.0HRCT-ND; Supplier 2: Mouser; Supplier Part Number 2: 603-RC0603FR-0747RL; Supplier 3: Farnell; Supplier Part Number 3: 9238328; AEC Qualified: ?; Green_EU RoHS: Passed with Exemption; Green_EU RoHS-2: Passed
R75 R81 R83 R88-R91 = CRCW060310K0FKEA: RES, 10.0 k, 1%, 0.1 W, 0603; Manufacturer: Vishay-Dale; CompType: Resistor; Value: 10.0k; Res_ohm: 10000; Value_Code: 10k0; Tolerance_%: 1; Power_W: 0.1; Value2: 0.1W; VDC_V: 75; TempCo: 100 ppm/C; SizeArea_mm2: 1.28; SizeX_mm: 1.6; SizeY_mm: 0.8; EIA_Code: E96; U/M: EA; AEC Category: Q200; Green_Lifecycle: Active; Green_REACh: Passed; SymbolVersion: 2009-05-29; PartNumber: CRCW060310K0FKEA; PackageReference: 0603; RoHS: Y; Value1: 1%; MountType: SMT; Technology: Thick Film; SizeZ_mm: 1; Published: 2008-06-26; Publisher: Texas Instruments; LatestRevisionDate: 2017-06-13; ComponentLink1Description: Datasheet link; ComponentLink1URL: http://www.vishay.com/docs/20035/dcrcwe3.pdf; Supplier 1: Digi-Key; Supplier Part Number 1: 541-10.0KHCT-ND; Supplier 2: Newark; Supplier Part Number 2: 52K8062; Supplier 3: Mouser; Supplier Part Number 3: 71-CRCW0603-10K-E3; AEC Qualified: ?; Green_EU RoHS: Passed with Exemption; Green_EU RoHS-2: Passed
R76-R80 = RC0603FR-07470RL: RES, 470, 1%, 0.1 W, 0603; Manufacturer: Yageo America; CompType: Resistor; Value: 470; Value_Code: 470R; Tolerance_%: 1; Power_W: 0.1; Value2: 0.1W; VDC_V: 150; TempCo: 200 ppm/C; SizeArea_mm2: 1.28; SizeX_mm: 1.6; SizeY_mm: 0.8; U/M: EA; AEC Category: Q200; Green_Lifecycle: Active; Green_REACh: Passed; SymbolVersion: 2009-05-29; PartNumber: RC0603FR-07470RL; PackageReference: 0603; RoHS: Y; Res_ohm: 470; Value1: 1%; MountType: SMT; Technology: Thick Film; SizeZ_mm: 1; Published: 2008-06-26; Publisher: Texas Instruments; LatestRevisionDate: 2017-06-13; ComponentLink1Description: Datasheet link; ComponentLink1URL: http://www.yageo.com/pdf/Pu-RC0603_51_PbFree_L_2.pdf; Supplier 1: Digi-Key; Supplier Part Number 1: 311-470HRCT-ND; Supplier 2: Mouser; Supplier Part Number 2: 603-RC0603FR-07470RL; Supplier 3: Farnell; Supplier Part Number 3: 9238441; AEC Qualified: ?; Green_EU RoHS: Passed with Exemption; Green_EU RoHS-2: Passed
R82 = RC0603FR-0747KL: RES, 47.0 k, 1%, 0.1 W, 0603; Manufacturer: Yageo America; CompType: Resistor; Value: 47.0k; Res_ohm: 47000; Value_Code: 47k0; Tolerance_%: 1; Power_W: 0.1; Value2: 0.1W; VDC_V: 150; TempCo: 200 ppm/C; SizeArea_mm2: 1.28; SizeX_mm: 1.6; SizeY_mm: 0.8; U/M: EA; AEC Category: Q200; Green_Lifecycle: Active; Green_REACh: Passed; SymbolVersion: 2009-05-29; PartNumber: RC0603FR-0747KL; PackageReference: 0603; RoHS: Y; Value1: 1%; MountType: SMT; Technology: Thick Film; SizeZ_mm: 1; Published: 2008-06-26; Publisher: Texas Instruments; LatestRevisionDate: 2017-06-13; ComponentLink1Description: Datasheet link; ComponentLink1URL: http://www.yageo.com/pdf/Pu-RC0603_51_PbFree_L_2.pdf; Supplier 1: Digi-Key; Supplier Part Number 1: 311-47.0KHRCT-ND; Supplier 2: Mouser; Supplier Part Number 2: 603-RC0603FR-0747KL; Supplier 3: Farnell; Supplier Part Number 3: 9238689; AEC Qualified: ?; Green_EU RoHS: Passed with Exemption; Green_EU RoHS-2: Passed
R84 R85 = CRCW0603100RFKEA: RES, 100, 1%, 0.1 W, 0603; Manufacturer: Vishay-Dale; CompType: Resistor; Value: 100; Value_Code: 100R; Tolerance_%: 1; Power_W: 0.1; Value2: 0.1W; VDC_V: 75; TempCo: 100 ppm/C; SizeArea_mm2: 1.28; SizeX_mm: 1.6; SizeY_mm: 0.8; EIA_Code: E96; U/M: EA; AEC Category: Q200; Green_Lifecycle: Active; Green_REACh: Passed; SymbolVersion: 2009-05-29; PartNumber: CRCW0603100RFKEA; PackageReference: 0603; RoHS: Y; Res_ohm: 100; Value1: 1%; MountType: SMT; Technology: Thick Film; SizeZ_mm: 1; Published: 2008-06-26; Publisher: Texas Instruments; LatestRevisionDate: 2017-06-13; ComponentLink1Description: Datasheet link; ComponentLink1URL: http://www.vishay.com/docs/20035/dcrcwe3.pdf; Supplier 1: Digi-Key; Supplier Part Number 1: 541-100HCT-ND; Supplier 2: Newark; Supplier Part Number 2: 52K8078; Supplier 3: Mouser; Supplier Part Number 3: 71-CRCW0603-100-E3; AEC Qualified: ?; Green_EU RoHS: Passed with Exemption; Green_EU RoHS-2: Passed
R86 = CRCW06036K80JNEA: RES, 6.8 k, 5%, 0.1 W, 0603; Manufacturer: Vishay-Dale; CompType: Resistor; Value: 6.8k; Res_ohm: 6800; Value_Code: 6k80; Tolerance_%: 5; Power_W: 0.1; Value2: 0.1W; VDC_V: 75; TempCo: 200 ppm/C; SizeArea_mm2: 1.28; SizeX_mm: 1.6; SizeY_mm: 0.8; SizeZ_mm: 1; EIA_Code: E24; U/M: EA; AEC Category: Q200; SymbolVersion: 2009-05-29; PartNumber: CRCW06036K80JNEA; PackageReference: 0603; RoHS: Y; Value1: 5%; MountType: SMT; Technology: Thick Film; Published: 2008-06-26; Publisher: Texas Instruments; LatestRevisionDate: 2017-06-13; ComponentLink1Description: Datasheet link; ComponentLink1URL: http://www.vishay.com/docs/20035/dcrcwe3.pdf; Supplier 1: Digi-Key; Supplier Part Number 1: 541-6.8KGCT-ND; Supplier 2: Newark; Supplier Part Number 2: 59M6827; Supplier 3: Mouser; Supplier Part Number 3: 71-CRCW0603J-6.8K-E3; AEC Qualified: ?
R87 = CRCW0603100KFKEA: RES, 100 k, 1%, 0.1 W, 0603; Manufacturer: Vishay-Dale; CompType: Resistor; Value: 100k; Res_ohm: 100000; Tolerance_%: 1; Power_W: 0.1; Value2: 0.1W; VDC_V: 75; TempCo: 100 ppm/C; SizeArea_mm2: 1.28; SizeX_mm: 1.6; SizeY_mm: 0.8; EIA_Code: E96; U/M: EA; AEC Category: Q200; Green_Lifecycle: Active; Green_REACh: Passed; SymbolVersion: 2009-05-29; PartNumber: CRCW0603100KFKEA; PackageReference: 0603; RoHS: Y; Value_Code: 100k; Value1: 1%; MountType: SMT; Technology: Thick Film; SizeZ_mm: 1; Published: 2008-06-26; Publisher: Texas Instruments; LatestRevisionDate: 2017-06-13; ComponentLink1Description: Datasheet link; ComponentLink1URL: http://www.vishay.com/docs/20035/dcrcwe3.pdf; Supplier 1: Digi-Key; Supplier Part Number 1: 541-100KHCT-ND; Supplier 2: Newark; Supplier Part Number 2: 42K3668; Supplier 3: Mouser; Supplier Part Number 3: 71-CRCW0603-100K-E3; AEC Qualified: ?; Green_EU RoHS: Passed with Exemption; Green_EU RoHS-2: Passed
R92 R93 = RC0603FR-0760R4L: RES, 60.4, 1%, 0.1 W, 0603; Manufacturer: Yageo America; CompType: Resistor; Value: 60.4; Value_Code: 60R4; Tolerance_%: 1; Power_W: 0.1; Value2: 0.1W; VDC_V: 150; TempCo: 200 ppm/C; SizeArea_mm2: 1.28; SizeX_mm: 1.6; SizeY_mm: 0.8; EIA_Code: E96; U/M: EA; AEC Category: Q200; SymbolVersion: 2009-05-29; PartNumber: RC0603FR-0760R4L; PackageReference: 0603; RoHS: Y; Res_ohm: 60.4; Value1: 1%; MountType: SMT; Technology: Thick Film; SizeZ_mm: 1; Published: 2008-06-26; Publisher: Texas Instruments; LatestRevisionDate: 2017-06-13; ComponentLink1Description: Datasheet link; ComponentLink1URL: http://www.yageo.com/pdf/Pu-RC0603_51_PbFree_L_2.pdf; Supplier 1: Digi-Key; Supplier Part Number 1: 311-60.4HRCT-ND; Supplier 2: Mouser; Supplier Part Number 2: 603-RC0603FR-0760R4L; AEC Qualified: ?
R94 = RC0603FR-07120RL: RES, 120, 1%, 0.1 W, 0603; Manufacturer: Yageo America; CompType: Resistor; Value: 120; Value_Code: 120R; Tolerance_%: 1; Power_W: 0.1; Value2: 0.1W; VDC_V: 150; TempCo: 200 ppm/C; SizeArea_mm2: 1.28; SizeX_mm: 1.6; SizeY_mm: 0.8; U/M: EA; AEC Category: Q200; Green_Lifecycle: Active; Green_REACh: Passed; SymbolVersion: 2009-05-29; PartNumber: RC0603FR-07120RL; PackageReference: 0603; RoHS: Y; Res_ohm: 120; Value1: 1%; MountType: SMT; Technology: Thick Film; SizeZ_mm: 1; Published: 2008-06-26; Publisher: Texas Instruments; LatestRevisionDate: 2017-06-13; ComponentLink1Description: Datasheet link; ComponentLink1URL: http://www.yageo.com/pdf/Pu-RC0603_51_PbFree_L_2.pdf; Supplier 1: Digi-Key; Supplier Part Number 1: 311-120HRCT-ND; Supplier 2: Mouser; Supplier Part Number 2: 603-RC0603FR-07120RL; Supplier 3: Farnell; Supplier Part Number 3: 9238379; AEC Qualified: ?; Green_EU RoHS: Passed with Exemption; Green_EU RoHS-2: Passed
RT4 = NTCALUG03A103G: Thermistor NTC, 10k ohm, 2%, NTC Thermistor, Mini Lug Sensor, Pitch 1.5mm; Manufacturer: Vishay-Bccomponents; Tolerance_%: 2; Power_W: 0.1; TaMin_C: -40; TaMax_C: 125; U/M: EA; CompType: ThermistorNTC; SymbolVersion: 2008-11-25; PartNumber: NTCALUG03A103G; Series: NTCALUG03; PackageReference: NTC Thermistor, Mini Lug Sensor, Pitch 1.5mm; MountType: TH; RoHS: Y; ComponentLink1Description: Datasheet link; ComponentLink1URL: http://www.vishay.com/docs/29114/ntcalug3.pdf; Published: 2009-09-22; Publisher: Texas Instruments; LatestRevisionDate: 2017-03-31; Supplier 1: Digi-Key; Supplier Part Number 1: BC2385-ND; Supplier 2: Newark; Supplier Part Number 2: 82T4011; Supplier 3: Mouser; Supplier Part Number 3: 594-NTCALUG03A103G
S2 = RS-032G05A3-SM RT: Switch, Tactile, SPST-NO, 0.05A, 12V, SMD; Manufacturer: C&K Components; SymbolCreator: a0799628; VDC_V: 12; SwitchFunction: Off-Mom; PositionCount: 1; CurrentRating_mA: 50; Green_Lifecycle: Not Set; Green_REACh: Incomplete; SymbolVersion: 2013-06-26; PartNumber: RS-032G05A3-SM RT; MountType: SMT; ComponentLink1Description: Datasheet URL; ComponentLink1URL: http://www.ck-components.com/83942/rs_18dec13.pdf/; RoHS: Y; Circuit: SPST-NO; Orientation: Top Actuated; CompType: Switch; PackageReference: SPST, 6x3.5mm; Publisher: Texas Instruments; LatestRevisionDate: 2017-06-14; Supplier 1: Digi-Key; Supplier Part Number 1: CKN10388CT-ND; Supplier 2: Mouser; Supplier Part Number 2: 611-RS-032G05A3-SMRT; Green_EU RoHS: Incomplete; Green_EU RoHS-2: Incomplete
T1 = 760390012: Transformer, 475 uH, SMT; Manufacturer: Wurth Elektronik; SymbolCreator: Altium; Value: 475uH; DCR_ohm: 0.31; Lp: 475; Ind_H: 0.000475; Ns1toNp: 1.1; Rsec1_ohm: 0.33; SizeAreaWB_mm2: 105.1965; SizeArea_mm2: 67.6365; SizeX_mm: 10.05; SizeY_mm: 6.73; SizeZ_mm: 4.19; SymbolVersion: 2016-07-22; PartNumber: 760390012; MountType: SMT; PackageReference: 7.14x6.73mm; RoHS: Y; ComponentLink1URL: http://katalog.we-online.de/ctm/datasheet/760390012.pdf; ComponentLink1Description: Datasheet URL; CompType: Transformer; Publisher: Texas Instruments; LatestRevisionDate: 2017-06-21; Supplier 1: Digi-Key; Supplier Part Number 1: 732-4456-1-ND; Supplier 2: Mouser; Supplier Part Number 2: 710-760390012
U2 U10 = TLV70433DBVR: Single Output LDO, 150 mA, Fixed 3.3 V Output, 2.5 to 24 V Input, with Ultra-Low IQ, 5-pin SOT-23 (DBV), -40 to 125 degC, Green (RoHS & no Sb/Br); Manufacturer: Texas Instruments; Alternate PartNumber: Equivalent; Accuracy(%): 2; Fixed Output Options(V): 3.3; Iout(Max)(A): 0.15; Iq(Typ)(mA): 0.003; SubFamily: Single Channel LDO; Vdo(Typ)(mV): 400; Vin(Max)(V): 24; Vin(Min)(V): 2.5; DatasheetVersion: SBVS148C; PackageVersion: 4073253-4/K; PackageReference: DBV0005A; PackageDescription: 5-Pin Plastic Small Outline, Body 1.60 Ã— 2.90 mm, Pitch 0.95 mm; Supplier 1: Digi-Key; Supplier Part Number 1: TLV70433DBVR-ND; Supplier 2: Newark; Supplier Part Number 2: 13T5913; Supplier 3: Mouser; Supplier Part Number 3: 595-TLV70433DBVR; Eco-Plan: Green (RoHS & no Sb/Br); Vout Adj(Max)(V): 3.3; Vout Adj(Min)(V): 3.3; MountType: SMT; Code_JEDEC: MO-178; PartNumber: TLV70433DBVR; ComponentLink1Description: Manufacturer URL; ComponentLink1URL: http://www.ti.com/; ComponentLink2Description: Datasheet; ComponentLink2URL: http://www.ti.com/general/docs/lit/getliterature.tsp?genericPartNumber=TLV70433&fileType=pdf; ComponentLink3Description: Package Specification; ComponentLink3URL: http://www.ti.com/litv/pdf/mpds018i; Alternate Manufacturer: Texas Instruments
U3 = CMP-0084060-1: 24MHz 105C ULP Microcontroller With 32 KB FRAM, 4 KB SRAM, 44 IO, 12-bit ADC, DBT0038A (TSSOP-38); Manufacturer: Texas Instruments; Rating: Catalog; SizeAreaWB_mm2: 98.28; SizeArea_mm2: 62.08; AEC Qualified: N; AEC Category: Q200; SizeZ_mm: 1.2; SizeY_mm: 9.7; CompType: IC; SizeX_mm: 6.4; ComponentLink1Description: Datasheet Link; RoHS: Y; ComponentLink2Description: Product Folder; PackageReference: DBT0038A; PartNumber: MSP430FR2155TDBTR; PackageDescription: TSSOP-38; ComponentLink2URL: http://www.ti.com/product/msp430fr2155; Alternate Manufacturer: Texas Instruments; ComponentLink3URL: http://www.ti.com/product/msp430fr2155/datasheet; ComponentLink1URL: http://www.ti.com/lit/ds/symlink/msp430fr2155.pdf; Alternate PartNumber: MSP430FR2155TDBT; MountType: SMT; ComponentLink3Description: Online Datasheet; Operating Temperature Range: -40 to 105 C
U4 = CMP-0082025-1: Multi-Chemistry Impedance Track Standalone Fuel Gauge; Alternate PartNumber: BQ34Z100PW-G1; Alternate Manufacturer: Texas Instruments; SizeAreaWB_mm2: 58.8; SizeZ_mm: 1.2; SizeX_mm: 6.4; SizeY_mm: 5; SizeArea_mm2: 32; CompType: IC; AEC Qualified: N; AEC Category: Q200; ComponentLink1URL: http://www.ti.com/lit/ds/symlink/bq34z100-g1.pdf; PackageDescription: TSSOP-14; RoHS: Y; MountType: SMT; ComponentLink2URL: http://www.ti.com/product/bq34z100-g1; ComponentLink3Description: Online Datasheet; ComponentLink2Description: Product Folder; Manufacturer: Texas Instruments; ComponentLink3URL: http://www.ti.com/product/bq34z100-g1/datasheet; PackageReference: PW0014A; Operating Temperature Range: -40 to 85 C; PartNumber: BQ34Z100PWR-G1; ComponentLink1Description: Datasheet Link
U5-U7 = TLP293(GB-TPL,E: Optocoupler, 3.75 kV, 100-600% CTR, SMT; Manufacturer: Toshiba; CTR (Min): 100%; CTR (Max): 600%; Voltage_Isolation_Vrms: 3750V; SizeAreaWB_mm2: 41.4; SizeArea_mm2: 18.2; SizeX_mm: 7; SizeY_mm: 2.6; SizeZ_mm: 2.2; SymbolVersion: 2015-11-09; PartNumber: TLP293(GB-TPL,E; CompType: Optocoupler; MountType: SMT; PackageReference: SOP, 4-Leads, Body 2.65x4.60mm, Pitch 1.27mm; RoHS: Y; ComponentLink1Description: Datasheet URL; ComponentLink1URL: https://toshiba.semicon-storage.com/info/docget.jsp?did=14419&prodName=TLP293; Publisher: Texas Instruments; LatestRevisionDate: 2017-01-30; Supplier 1: Digi-Key; Supplier Part Number 1: TLP293(GB-TPLECT-ND; Supplier 2: Mouser; Supplier Part Number 2: 757-TLP293GB-TPLE
U8 = CMP-0065840-1: Low-Noise 350 mA, 410 kHz Transformer Driver, DBV0005A (SOT-23-5); Alternate PartNumber: SN6501DBVT; Alternate Manufacturer: Texas Instruments; Green_Lifecycle: Not Set; SizeAreaWB_mm2: 14.82; Green_REACh: Passed; U/M: EA; SizeZ_mm: 1.45; SizeX_mm: 2.8; SizeY_mm: 2.9; SizeArea_mm2: 8.12; CompType: IC; ComponentLink1URL: http://www.ti.com/lit/ds/symlink/sn6501.pdf; Publisher: Texas Instruments; PackageDescription: SOT-23-5; RoHS: Y; Footprint Path 6: C:\AltiumLibraries\Footprints\TI\.PcbLib; MountType: SMT; Green_EU RoHS-2: Passed; Manufacturer: Texas Instruments; Green_EU RoHS: Passed; PackageReference: DBV0005A; LatestRevisionDate: 2017-06-09; PartNumber: SN6501DBVR; ComponentLink1Description: Datasheet Link
U9 = CMP-0077952-1: Reinforced Isolated CAN XCVRs with 70V Protection Voltage and CAN FD, DWV0008A (SOIC-8); Alternate Manufacturer: Texas Instruments; SizeAreaWB_mm2: 105.975; SizeZ_mm: 2.8; SizeX_mm: 11.5; SizeY_mm: 5.85; SizeArea_mm2: 67.275; CompType: IC; AEC Qualified: N; AEC Category: Q200; ComponentLink1URL: https://sps16.itg.ti.com/sites/KMS/crossdivteams/altium/docs/ComponentDatasheets/ISO1042-PPV.pdf; Alternate PartNumber: ISO1042BDWV; PackageDescription: SOIC-8; MountType: SMT; ComponentLink2URL: TBD; ComponentLink2Description: Product Folder; Manufacturer: Texas Instruments; PackageReference: DWV0008A; PartNumber: ISO1042BDWVR; ComponentLink1Description: Datasheet Link
U11 = CMP-0013008-2: 250 kbps RS-485 Transceivers With +/-12-kV IEC ESD Protection, D0008A (SOIC-8); Manufacturer: Texas Instruments; SizeX_mm: 4.9; SizeY_mm: 6.2; CompType: IC; SizeZ_mm: 1.75; SizeArea_mm2: 30.38; SizeAreaWB_mm2: 56.58; U/M: EA; PackageDescription: SOIC-8; PartNumber: THVD1500DR; ComponentLink1URL: https://sps06.itg.ti.com/sites/KMS/crossdivteams/altium/docs/ComponentDatasheets/THVD1500.pdf; ComponentLink1Description: Datasheet Link; LatestRevisionDate: 2017-03-09; Publisher: Texas Instruments; PackageReference: D0008A; MountType: SMT; Alternate Manufacturer: Texas Instruments; Alternate PartNumber: THVD1500D
U12 = TLV70450DBVT: Single Output LDO, 150 mA, Fixed 5 V Output, 2.5 to 24 V Input, with Ultra-Low IQ, 5-pin SOT-23 (DBV), -40 to 125 degC, Green (RoHS & no Sb/Br); Manufacturer: Texas Instruments; Alternate PartNumber: Equivalent; Accuracy(%): 2; Fixed Output Options(V): 5; Iout(Max)(A): 0.15; Iq(Typ)(mA): 0.003; SubFamily: Single Channel LDO; Vdo(Typ)(mV): 400; Vin(Max)(V): 24; Vin(Min)(V): 2.5; DatasheetVersion: SBVS148C; PackageVersion: 4073253-4/K; PackageReference: DBV0005A; PackageDescription: 5-Pin Plastic Small Outline, Body 1.60 Ã— 2.90 mm, Pitch 0.95 mm; Supplier 1: Digi-Key; Supplier Part Number 1: 296-28171-2-ND; Supplier 2: Digi-Key; Supplier Part Number 2: 296-28171-1-ND; Supplier 3: Digi-Key; Supplier Part Number 3: 296-28171-6-ND; Eco-Plan: Green (RoHS & no Sb/Br); Vout Adj(Max)(V): 5; Vout Adj(Min)(V): 5; MountType: SMT; Code_JEDEC: MO-178; PartNumber: TLV70450DBVT; ComponentLink1Description: Manufacturer URL; ComponentLink1URL: http://www.ti.com/; ComponentLink2Description: Datasheet; ComponentLink2URL: http://www.ti.com/general/docs/lit/getliterature.tsp?genericPartNumber=TLV70450&fileType=pdf; ComponentLink3Description: Package Specification; ComponentLink3URL: http://www.ti.com/litv/pdf/mpds018i; Alternate Manufacturer: Texas Instruments; Supplier 4: Newark; Supplier Part Number 4: 27T6807; Supplier 5: Mouser; Supplier Part Number 5: 595-TLV70450DBVT
U13 = TPD2E007DCKR: ESD Protection Array for AC Signal Data Interface, 2 Channels, -40 to +85 degC, 3-pin SC70 (DCK), Green (RoHS & no Sb/Br); Manufacturer: Texas Instruments; Alternate PartNumber: Equivalent; Breakdown Voltage(Min)(V): +/-14; IEC 61000-4-2 Air-Gap(+/- kV): 15; IEC 61000-4-2 Contact(+/- kV): 8; IO Leakage Current(nA): 50; SubFamily: ESD Solution; DatasheetVersion: SLVS796E; PackageVersion: revG, Jan-2007; PackageReference: DCK0003A; PackageDescription: 3-Pin Plastic Small-Outline Package, 0.65 mm Pitch, 2.1 mm Lead Span; Supplier 1: Digi-Key; Supplier Part Number 1: 296-25281-2-ND; Supplier 2: Digi-Key; Supplier Part Number 2: 296-25281-1-ND; Supplier 3: Digi-Key; Supplier Part Number 3: 296-25281-6-ND; Supplier 4: Farnell; Supplier Part Number 4: 2120465; Supplier 5: Newark; Supplier Part Number 5: 94T5089; Supplier 6: Newark; Supplier Part Number 6: 55R7554; Supplier 7: Mouser; Supplier Part Number 7: 595-TPD2E007DCKR; Eco-Plan: Green (RoHS & no Sb/Br); IO Capacitance(Typ)(pF): 15; MountType: SMT; PartNumber: TPD2E007DCKR; ComponentLink1Description: Datasheet; ComponentLink1URL: http://www.ti.com/general/docs/lit/getliterature.tsp?genericPartNumber=TPD2E007&fileType=pdf; ComponentLink2Description: URL Link1; ComponentLink2URL: SamplesURL:http://www.ti.com/product/tpd2e007#samples; Alternate Manufacturer: Texas Instruments